# EasyEDA Pro project stm32控制的单相交流调压电路.eprj

# Schematic stm32控制的单相交流调压电路
Board Name: stm32控制的单相交流调压电路; Create Date: 2024-12-09; Page Name: main; Project Name: stm32控制的单相交流调压电路; Schematic Name: stm32控制的单相交流调压电路; Update Date: 2024-12-09; Company: 仲恺农业工程学院; Drawed: 自动化214呙凯锋; Page Size: A4; Version: V1.0
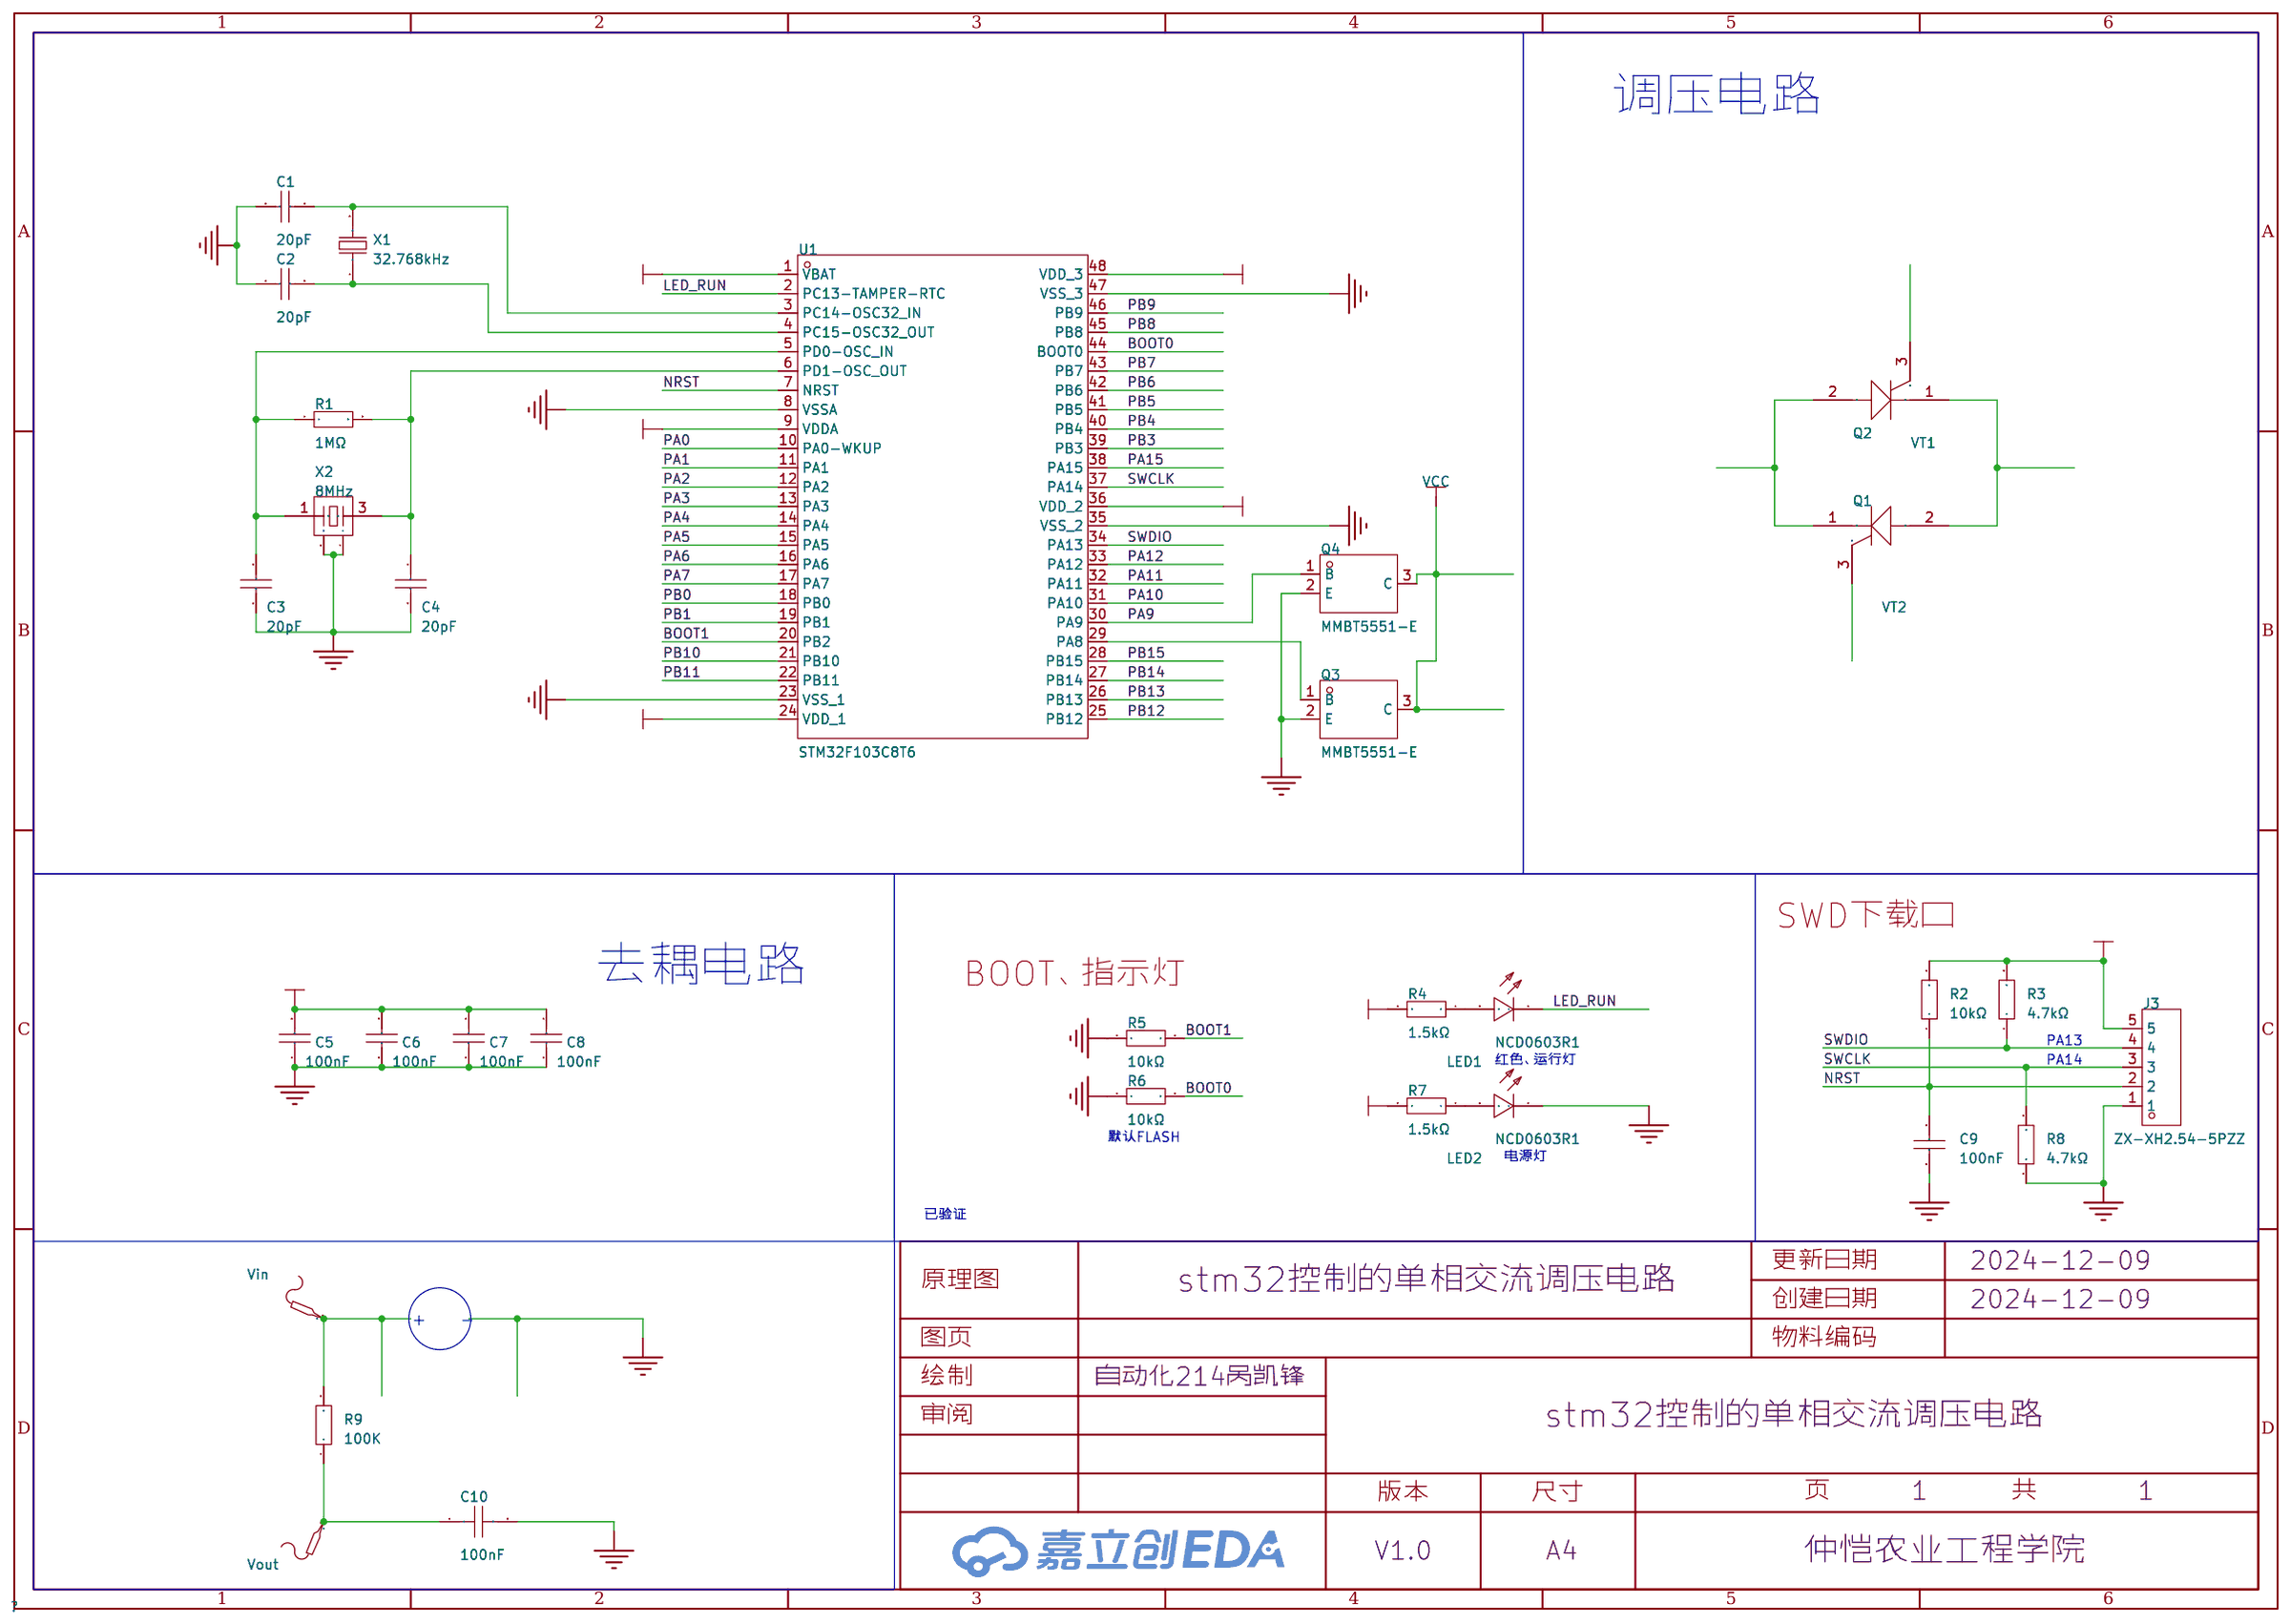
[diagram p0: schematic sheet]

## Parts
C1  20pF  [C0603]
C2  20pF  [C0603]
C3  20pF  [C0603]
C4  20pF  [C0603]
C5  100nF  [C0603]
C6  100nF  [C0603]
C7  100nF  [C0603]
C8  100nF  [C0603]
C9  100nF  [C0603]
C10  100nF  [C0603]
J3  ZX-XH2.54-5PZZ  [CONN-TH_5P-P2.50_ZX-XH2.54-5PZZ]
LED1  NCD0603R1  [LED0603-RD_RED]
LED2  NCD0603R1  [LED0603-RD_RED]
Q1  VT2  [DPAK-3_L6.6-W6.1-P2.28-LS9.9-BR]
Q2  VT1  [DPAK-3_L6.6-W6.1-P2.28-LS9.9-BR]
Q3  MMBT5551-E  [SOT-23-3_L2.9-W1.8-P1.90-LS2.4-BR]
Q4  MMBT5551-E  [SOT-23-3_L2.9-W1.8-P1.90-LS2.4-BR]
R1  1MΩ  [R0603]
R2  10kΩ  [R0603]
R3  4.7kΩ  [R0603]
R4  1.5kΩ  [R0603]
R5  10kΩ  [R0603]
R6  10kΩ  [R0603]
R7  1.5kΩ  [R0603]
R8  4.7kΩ  [R0603]
R9  100K  [R0603]
U1  STM32F103C8T6  [LQFP-48_L7.0-W7.0-P0.50-LS9.0-BL]
Vin  -  [Test-Point-0.5mm]
Vout  -  [Test-Point-0.5mm]
X1  32.768kHz  [FC-135R_L3.2-W1.5]
X2  8MHz  [OSC-SMD_4P-L5.0-W3.2-BL]

## Library data of the parts
C1-C4 = CL10C200JB8NNNC: 容值:20pF;精度:±5%;额定电压:50V;材质(温度系数):C0G;; LCSC Part Name: 20pF ±5% 50V; Supplier Part: C1648; Manufacturer: SAMSUNG(三星); Supplier Footprint: 0603; JLCPCB Part Class: 基础库; Datasheet: https://atta.szlcsc.com/upload/public/pdf/source/20160218/1457707763339.pdf; Supplier: LCSC; Tolerance: ±5%; Voltage Rated: 50V; Temperature Coefficient: C0G
C5-C9 = CC0603KRX7R9BB104: 容值:100nF;精度:±10%;额定电压:50V;材质(温度系数):X7R;; LCSC Part Name: 100nF ±10% 50V; Supplier Part: C14663; Manufacturer: YAGEO(国巨); Supplier Footprint: 0603; JLCPCB Part Class: 基础库; Datasheet: https://atta.szlcsc.com/upload/public/pdf/source/20180910/C282072_33301C7F631E79921B82A8DAC6BCC5B3.pdf; Supplier: LCSC; Tolerance: ±10%; Voltage Rated: 50V; Temperature Coefficient: X7R
C10 = CAP_0603: Supplier Footprint: 0603
J3 = ZX-XH2.54-5PZZ: 插针结构:1x5P;间距:2.54mm;安装方式:直插;参考系列:XH;总PIN数:5P;排数:1;每排PIN数:5;行距:-;额定电流:3A;触头材质:黄铜;触头镀层:锡;工作温度范围:-25℃~+85℃;; Supplier Part: C7429635; Manufacturer: Megastar(兆星); Supplier Footprint: 插件,P=2.54mm; JLCPCB Part Class: 扩展库; Datasheet: https://atta.szlcsc.com/upload/public/pdf/source/20230619/60EEF4ADD558E90BFFACF5D939816781.pdf; Supplier: LCSC; Pins Structure: 1x5P; Pitch: 2.54mm; Mounting Style: 直插; Reference Series: XH; Number of Pins: 5P; Number of Rows: 1; Number of PINs Per Row: 5; Current Rating (Max): 3A; Contact Material: 黄铜; Contact Plating: 锡; Operating Temperature Range: -25℃~+85℃
LED1 LED2 = NCD0603R1_C84263: 灯头类型:-;发光颜色:红色;正向电压(VF):1.6V~2.6V;功率:65mW;正向电流:20mA;主波长:615nm~630nm;二极管配置:独立二极管;透镜颜色:无色透明透镜;色温:-;发光强度:80mcd~220mcd;发光角度:130°;载带方式:-;工作温度:-30℃~+85℃;; Supplier Part: C84263; Manufacturer: 国星光电; Supplier Footprint: 0603; JLCPCB Part Class: 扩展库; Datasheet: https://atta.szlcsc.com/upload/public/pdf/source/20200820/C84263_DABC6A75E58F576973B407FDBA283D60.pdf; Supplier: LCSC; Emitted Color: 红色; Forward Voltage (VF): 1.6V~2.6V; Power Dissipation: 65mW; Forward Current: 20mA; Dominant Wavelength: 615nm~630nm; Diode Configuration: 独立二极管; Lens Color: 无色透明透镜; Luminous Intensity: 80mcd~220mcd; Viewing Angle: 130°; Operating Temperature: -30℃~+85℃
Q1 Q2 = BT151S-500R,118: 可控硅类型:1个单向可控硅;保持电流(Ih):20mA;断态峰值电压(Vdrm):500V;门极触发电流(Igt):15mA;; Supplier Part: C909686; Manufacturer: WeEn(瑞能); Supplier Footprint: DPAK; JLCPCB Part Class: 扩展库; Datasheet: https://atta.szlcsc.com/upload/public/pdf/source/20201023/C909686_0B35B9AF067EED6C5B9ABE2201E4480A.pdf; Supplier: LCSC; SCR Type: 1个单向可控硅; Gate Trigger   Voltage (Vgt): 1.5V; Holding Current (Ih): 20mA; Peak Repetitive Off?State Voltage (Vdrm): 500V; Gate Trigger Current(Igt): 15mA; Peak Forward On?State Voltage (Vtm): 1.75V; RMS On-State Current(It (rms)): 12A; Operating Temperature: -40℃~+125℃
Q3 Q4 = MMBT5551-E: 晶体管类型:NPN;集电极电流(Ic):600mA;集射极击穿电压(Vceo):160V;功率(Pd):300mW;直流电流增益(hFE@Ic,Vce):80@1mA,5V;; LCSC Part Name: NPN 电流:600mA 耐压:160V; Supplier Part: C41371418; Manufacturer: MDD(辰达半导体); Supplier Footprint: SOT-23; JLCPCB Part Class: 扩展库; Datasheet: https://atta.szlcsc.com/upload/public/pdf/source/20241113/0C9B68AE5C245EBCD1861CC91D852F33.pdf; Supplier: LCSC; Transistor Type: NPN; Collector Current (Ic): 600mA; Collector-Emitter Breakdown Voltage (Vceo): 160V; Power Dissipation (Pd): 300mW; DC Current Gain (hFE@Ic,Vce): 80@1mA,5V; Transition Frequency (fT): 100MHz; Collector Cut-Off Current (Icbo): 50nA; Collector-Emitter Saturation Voltage (VCE(sat)@Ic,Ib): 150mV@10mA,1mA; Operating Temperature: -55℃~+150℃
R1 = 0603WAF1004T5E: 电阻类型:厚膜电阻;阻值:1MΩ;精度:±1%;功率:100mW;最大工作电压:75V;温度系数:±100ppm/℃;; LCSC Part Name: 1MΩ ±1% 100mW 厚膜电阻; Supplier Part: C22935; Manufacturer: UNI-ROYAL(厚声); Supplier Footprint: 0603; JLCPCB Part Class: 基础库; Datasheet: https://atta.szlcsc.com/upload/public/pdf/source/20200306/C422600_1E6D84923E4A46A82E41ADD87F860B5C.pdf; Supplier: LCSC; Type: 厚膜电阻; Tolerance: ±1%; Power(Watts): 100mW; Overload Voltage (Max): 75V; Temperature Coefficient: ±100ppm/℃; Operating Temperature Range: -55℃~+155℃
R2 R5 R6 = 0603WAF1002T5E: 电阻类型:厚膜电阻;阻值:10kΩ;精度:±1%;功率:100mW;最大工作电压:75V;温度系数:±100ppm/℃;; LCSC Part Name: 厚膜电阻 10kΩ ±1% 100mW; Supplier Part: C25804; Manufacturer: UNI-ROYAL(厚声); Supplier Footprint: 0603; JLCPCB Part Class: 基础库; Datasheet: https://atta.szlcsc.com/upload/public/pdf/source/20200306/C422600_1E6D84923E4A46A82E41ADD87F860B5C.pdf; Supplier: LCSC; Type: 厚膜电阻; Tolerance: ±1%; Power(Watts): 100mW; Overload Voltage (Max): 75V; Temperature Coefficient: ±100ppm/℃; Operating Temperature Range: -55℃~+155℃
R3 R8 = 0603WAF4701T5E: 电阻类型:厚膜电阻;阻值:4.7kΩ;精度:±1%;功率:100mW;最大工作电压:75V;温度系数:±100ppm/℃;; LCSC Part Name: 4.7kΩ ±1% 100mW 厚膜电阻; Supplier Part: C23162; Manufacturer: UNI-ROYAL(厚声); Supplier Footprint: 0603; JLCPCB Part Class: 基础库; Datasheet: https://atta.szlcsc.com/upload/public/pdf/source/20200306/C422600_1E6D84923E4A46A82E41ADD87F860B5C.pdf; Supplier: LCSC; Type: 厚膜电阻; Tolerance: ±1%; Power(Watts): 100mW; Overload Voltage (Max): 75V; Temperature Coefficient: ±100ppm/℃; Operating Temperature Range: -55℃~+155℃
R4 R7 = 0603WAF1501T5E: 电阻类型:厚膜电阻;阻值:1.5kΩ;精度:±1%;功率:100mW;最大工作电压:75V;温度系数:±100ppm/℃;; LCSC Part Name: 1.5kΩ ±1% 100mW 厚膜电阻; Supplier Part: C22843; Manufacturer: UNI-ROYAL(厚声); Supplier Footprint: 0603; Datasheet: https://atta.szlcsc.com/upload/public/pdf/source/20200306/C422600_1E6D84923E4A46A82E41ADD87F860B5C.pdf; Supplier: LCSC; Type: 厚膜电阻; Tolerance: ±1%; Power(Watts): 100mW; Overload Voltage (Max): 75V; Temperature Coefficient: ±100ppm/℃; Operating Temperature Range: -55℃~+155℃
R9 = Res_0603: Supplier Footprint: 0603
U1 = STM32F103C8T6: CPU内核:ARM-M3;程序存储容量:64KB;RAM总容量:20KB;GPIO端口数量:37;工作电压范围:2V~3.6V;CPU最大主频:72MHz;程序存储器类型:FLASH;; LCSC Part Name: 主流增强型ARM Cortex-M3 MCU，具有64 KB Flash、72 MHz CPU、电机控制、USB和CAN; Supplier Part: C8734; Manufacturer: ST(意法半导体); Supplier Footprint: LQFP-48(7x7); JLCPCB Part Class: 扩展库; Datasheet: https://atta.szlcsc.com/upload/public/pdf/source/20220812/8363ACEC51AD55ECEB84799464F7CB85.pdf; Supplier: LCSC; CPU Core: ARM-M3; Program Storage Size: 64KB; RAM Size: 20KB; GPIO Ports Number: 37; Operating Voltage Range: 2V~3.6V; CPU Maximum Speed: 72MHz; Program Memory Type: FLASH; Operating Temperature Range: -40℃~+85℃; ADC (Bit): 12bit; Universal Serial Bus: 有; Peripheral/Function: 看门狗；DMA；看门狗；温度传感器; Watchdog: 有; Infrared Data Association: 有; Low-Voltage Detect: 有; Direct Memory Access: 有; Internal Oscillator: 有
Vin Vout = Test-Point: Test Point 测试点
X1 = Q13FC13500004_C32346: 晶振类型:贴片晶振;频率:32.768kHz;常温频差:±20ppm;外接负载电容:12.5pF;; LCSC Part Name: 32.768kHz ±20ppm 12.5pF; Supplier Part: C32346; Manufacturer: EPSON(爱普生); Manufacturer Part: Q13FC13500004; Supplier Footprint: SMD3215-2P; JLCPCB Part Class: 基础库; Datasheet: https://atta.szlcsc.com/upload/public/pdf/source/20240418/0E0FF5F0356BA3753F616001439D1416.pdf; Supplier: LCSC; Crystal Type: 贴片晶振; Normal temperature Frequency Tolerance: ±20ppm; External load capacitor: 12.5pF; Equivalent Series Resistance (ESR): 70kΩ; Operating Temperature: -40℃~+85℃
X2 = X50328MSB4SI: 晶振类型:贴片晶振;频率:8MHz;常温频差:±10ppm;外接负载电容:20pF;频率稳定度(全温):±20ppm;; LCSC Part Name: 8MHz ±10ppm 20pF; Supplier Part: C157341; Manufacturer: YXC(扬兴晶振); Supplier Footprint: SMD5032-4P; JLCPCB Part Class: Extended Part; Datasheet: https://atta.szlcsc.com/upload/public/pdf/source/20240329/327CA683A00C8316374FE0D2B6DB5109.pdf; Supplier: LCSC; Crystal Type: 贴片晶振; Normal temperature Frequency Tolerance: ±10ppm; External load capacitor: 20pF; Frequency Stability(Full temperature range): ±20ppm; Operating Temperature: -40℃~+85℃; Origin Footprint 1: OSC 5032-4P; Design Item ID: XTAL-4P; Library Name: 2.0 - 保险丝-晶振-光耦; BOM名称: 4脚无源晶振; 学习资源: https://shop463601444.taobao.com; 版权归属: 封装库来自淘宝卖家 ID：黄晶宝石; Origin Footprint 2: OSC 1612-4P; Origin Footprint 3: OSC 2025-4P; Origin Footprint 4: OSC 3225-4P; Origin Footprint 5: OSC 4025-4P; Origin Footprint 6: OSC 6035-4P; Origin Footprint 7: OSC 7050-4P; Origin Footprint 8: OSC 8045-4P; Origin Footprint 9: OSC 8045-4P-C; Origin Footprint 10: OSC 2016-4P

## Nets
GND: C1.1 C2.1 C3.2 C4.2 C5.1 C6.1 C7.1 C8.1 C9.2 C10.2 J3.1 LED2.1(K) Q3.2(E) Q4.2(E) R5.1 R6.1 R8.1 U1.8(VSSA) U1.23(VSS_1) U1.35(VSS_2) U1.47(VSS_3) X2.2 X2.4
VCC: Q3.3(C) Q4.3(C)
VDD_3V3: C5.2 C6.2 C7.2 C8.2 J3.5 R2.2 R3.2 R4.2 R7.2 U1.1(VBAT) U1.9(VDDA) U1.24(VDD_1) U1.36(VDD_2) U1.48(VDD_3)
BOOT0: R6.2 U1.44(BOOT0)
BOOT1: R5.2 U1.20(PB2)
LED_RUN: LED1.1(K) U1.2(PC13-TAMPER-RTC)
NRST: C9.1 J3.2 R2.1 U1.7(NRST)
PA0: U1.10(PA0-WKUP)
PA1: U1.11(PA1)
PA2: U1.12(PA2)
PA3: U1.13(PA3)
PA4: U1.14(PA4)
PA5: U1.15(PA5)
PA6: U1.16(PA6)
PA7: U1.17(PA7)
PA9: Q4.1(B) U1.30(PA9)
PA10: U1.31(PA10)
PA11: U1.32(PA11)
PA12: U1.33(PA12)
PA15: U1.38(PA15)
PB0: U1.18(PB0)
PB1: U1.19(PB1)
PB3: U1.39(PB3)
PB4: U1.40(PB4)
PB5: U1.41(PB5)
PB6: U1.42(PB6)
PB7: U1.43(PB7)
PB8: U1.45(PB8)
PB9: U1.46(PB9)
PB10: U1.21(PB10)
PB11: U1.22(PB11)
PB12: U1.25(PB12)
PB13: U1.26(PB13)
PB14: U1.27(PB14)
PB15: U1.28(PB15)
SWCLK: J3.3 R8.2 U1.37(PA14)
SWDIO: J3.4 R3.1 U1.34(PA13)
$1N739: LED1.2(A) R4.1
$1N743: LED2.2(A) R7.1
$1N1095: C3.1 R1.1 U1.5(PD0-OSC_IN) X2.1
$1N1097: C4.1 R1.2 U1.6(PD1-OSC_OUT) X2.3
$1N1874: C2.2 U1.4(PC15-OSC32_OUT) X1.1
$1N1879: C1.2 U1.3(PC14-OSC32_IN) X1.2
$1N4613: Q1.2(A) Q2.1(K)
$1N4619: Q1.1(K) Q2.2(A)
$1N4761: Q3.1(B) U1.29(PA8)
$1N5233: R9.2 Vin.1
$1N5237: C10.1 R9.1 Vout.1

Not connected (* = marked no-connect by the designer): Q1 3(G); Q2 3(G)

## Notes on the sheet
- 调压电路
- SWD下载口
- 去耦电路
- BOOT、指示灯
- PA13
- 红色、运行灯
- PA14
- 默认FLASH
- 电源灯
- 已验证
- +
- -

# Board stm32控制的单相交流调压电路
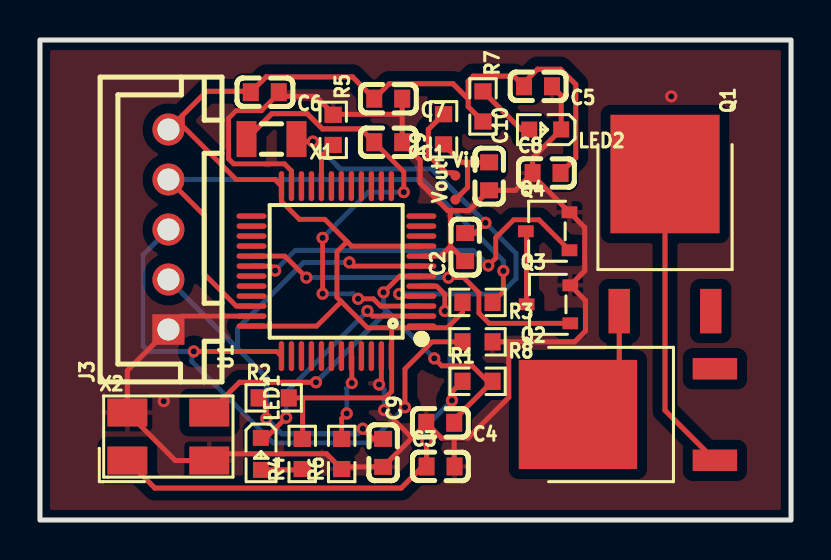
[diagram p1: board, top side]
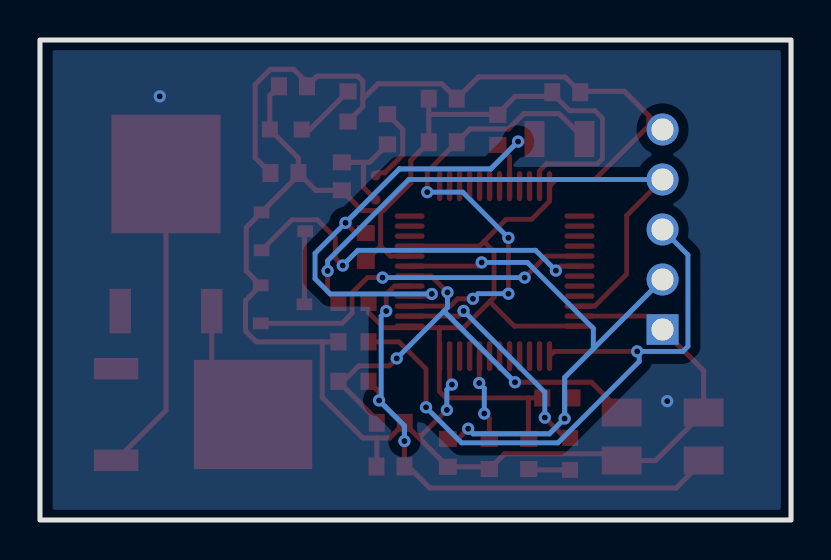
[diagram p2: board, bottom side, seen from below]

Outline 37.59 x 24 mm; copper layers: Top Layer, Bottom Layer. Coordinates in mm from the lower left corner of the outline.
Outline path: rectangle 0,24 37.59,0
Stack: Top Layer 0.035mm / Dielectric1 1.51mm FR4 er 4.5 / Bottom Layer 0.035mm

## Design rules (mm)
template: 自定义配置
spacing copperThickness1oz (default): track to track 0.102, other pairs 0.152 to 0.3
spacing copperThickness2oz: track to track 0.203, other pairs 0.152 to 0.3
track width copperThickness1oz (default): min 0.127, default 0.254, max 2.54
track width copperThickness2oz: min 0.203, default 0.254, max 2.54
differential pair differentialPair (default): width min 0.127, default 0.254, max 2.54; gap min 0.152, default 0.152
via viaSize (default): diameter min 0.5, default 0.61, max 10; hole min 0.3, default 0.305, max 6.3

## Placement (name value [footprint] x y rotation side)
C1  20pF  [C0603]  17.43 18.89 180 top
C2  20pF  [C0603]  21.28 13.65 90 top
C3  20pF  [C0603]  20.05 2.68 0 top
C4  20pF  [C0603]  20.03 4.86 180 top
C5  100nF  [C0603]  24.93 21.69 180 top
C6  100nF  [C0603]  11.25 21.39 180 top
C7  100nF  [C0603]  17.43 21.07 180 top
C8  100nF  [C0603]  25.36 17.35 0 top
C9  100nF  [C0603]  17.17 3.36 270 top
C10  100nF  [C0603]  22.48 17.19 270 top
J3  ZX-XH2.54-5PZZ  [CONN-TH_5P-P2.50_ZX-XH2.54-5PZZ]  6.43 14.53 90 top
LED1  NCD0603R1  [LED0603-RD_RED]  11.06 3.31 270 top
LED2  NCD0603R1  [LED0603-RD_RED]  25.29 19.52 180 top
Q1  VT2  [DPAK-3_L6.6-W6.1-P2.28-LS9.9-BR]  31.28 13.87 270 top
Q2  VT1  [DPAK-3_L6.6-W6.1-P2.28-LS9.9-BR]  30.35 5.27 0 top
Q3  MMBT5551-E  [SOT-23-3_L2.9-W1.8-P1.90-LS2.4-BR]  25.45 10.79 0 top
Q4  MMBT5551-E  [SOT-23-3_L2.9-W1.8-P1.90-LS2.4-BR]  25.41 14.44 0 top
R1  1MΩ  [R0603]  21.9 6.94 0 top
R2  10kΩ  [R0603]  11.7 6.11 0 top
R3  4.7kΩ  [R0603]  21.9 10.88 180 top
R4  1.5kΩ  [R0603]  13.13 3.3 90 top
R5  10kΩ  [R0603]  14.68 19.51 270 top
R6  10kΩ  [R0603]  15.1 3.3 90 top
R7  1.5kΩ  [R0603]  22.17 20.68 270 top
R8  4.7kΩ  [R0603]  21.9 8.91 180 top
R9  100K  [R0603]  20.2 19.54 90 top
U1  STM32F103C8T6  [LQFP-48_L7.0-W7.0-P0.50-LS9.0-BL]  14.84 12.45 90 top
Vin  -  [Test-Point-0.5mm]  20.79 17.22 0 top
Vout  -  [Test-Point-0.5mm]  20.79 16.02 90 top
X1  32.768kHz  [FC-135R_L3.2-W1.5]  11.59 19.05 180 top
X2  8MHz  [OSC-SMD_4P-L5.0-W3.2-BL]  6.43 4.17 0 top

## Footprints (pads in the part's own frame, mm; a bottom-side part is the same pattern mirrored in y, then rotated)
C0603
  rect 0.8x0.9 smd: 1(-0.7,0) 2(0.7,0)
CONN-TH_5P-P2.50_ZX-XH2.54-5PZZ
  rect 1.524x1.6 hole 1.1: 1(-5,0)
  round 1.6 hole 1.1: 2(-2.5,0) 3(0,0) 4(2.5,0) 5(5,0)
DPAK-3_L6.6-W6.1-P2.28-LS9.9-BR
  rect 2.223x1.071 smd: 1(3.428,-2.29) 3(3.428,2.29)
  rect 5.925x5.46 smd: 2(-3.428,0)
FC-135R_L3.2-W1.5
  rect 1x1.8 smd: 1(-1.25,0) 2(1.25,0)
LED0603-RD_RED
  rect 0.8x0.8 smd: 1(-0.799,-0.004) 2(0.799,0.004)
LQFP-48_L7.0-W7.0-P0.50-LS9.0-BL
  oval 0.27x1.5 smd: 1(-2.75,-4.25) 2(-2.25,-4.25) 3(-1.75,-4.25) 4(-1.25,-4.25) 5(-0.75,-4.25) 6(-0.25,-4.25) 7(0.25,-4.25) 8(0.75,-4.25) 9(1.25,-4.25) 10(1.75,-4.25) 11(2.25,-4.25) 12(2.75,-4.25) 25(2.75,4.25) 26(2.25,4.25) 27(1.75,4.25) 28(1.25,4.25) 29(0.75,4.25) 30(0.25,4.25) 31(-0.25,4.25) 32(-0.75,4.25) 33(-1.25,4.25) 34(-1.75,4.25) 35(-2.25,4.25) 36(-2.75,4.25)
  oval 1.5x0.27 smd: 13(4.25,-2.75) 14(4.25,-2.25) 15(4.25,-1.75) 16(4.25,-1.25) 17(4.25,-0.75) 18(4.25,-0.25) 19(4.25,0.25) 20(4.25,0.75) 21(4.25,1.25) 22(4.25,1.75) 23(4.25,2.25) 24(4.25,2.75) 37(-4.25,2.75) 38(-4.25,2.25) 39(-4.25,1.75) 40(-4.25,1.25) 41(-4.25,0.75) 42(-4.25,0.25) 43(-4.25,-0.25) 44(-4.25,-0.75) 45(-4.25,-1.25) 46(-4.25,-1.75) 47(-4.25,-2.25) 48(-4.25,-2.75)
OSC-SMD_4P-L5.0-W3.2-BL
  rect 2x1.4 smd: 1(-2.05,-1.2) 2(2.05,-1.2) 3(2.05,1.2) 4(-2.05,1.2)
R0603
  rect 0.806x0.864 smd: 1(-0.753,0) 2(0.753,0)
SOT-23-3_L2.9-W1.8-P1.90-LS2.4-BR
  rect 0.785x0.595 smd: 1(1.093,-0.95) 2(1.093,0.95) 3(-1.093,0)
Test-Point-0.5mm
  round 0.5 smd: 1(0,0)

## Nets
As in the schematic.

## Via types
v1: diameter 0.61, hole 0.305, Top Layer to Bottom Layer, 31 vias

## Routing (per net, layer and track width the routed paths; a pad name or vN(x,y) marks a point on that pad's centre or on a via; arc(x,y) is an arc through that point)
GND: length 92.8
  Top Layer w0.243: v1(17.23,5.5) 18.5,4.23 18.75,4.23 ; v1(16.97,6.77) 17.09,6.89 17.09,8.2 ; 11.98,21.36 11.08,20.47 9.81,20.47 9.44,20.09 9.44,18.06 9.7,17.81 12.24,17.81 12.59,17.46 U1.23 ; U1.8 20.05,13.2 20.54,13.69 ; U1.35 7.1,10.2 J3.1
  Top Layer w0.254: 20.54,15.47 20.42,15.47 19.03,16.86 19.03,17.99 C1.1 18.13,20.29 ; 20.54,15.47 20.54,13.69 21.28,12.95 ; 20.54,15.47 21.46,15.47 C10.2 23.79,16.49 24.46,17.16 ; C5.1 26.09,21.23 LED2.1 24.66,18.1 C8.1 24.46,17.16 ; 23.46,8.91 23.46,6.13 21.43,4.1 20.73,4.1 ; 23.46,8.91 R8.1 ; 23.46,8.91 26.76,8.91 27.3,9.45 27.3,10.97 Q3.2 27.27,12.46 27.27,14.63 Q4.2 24.73,17.16 24.46,17.16 ; 20.73,4.1 20.1,4.1 C4.2 19.33,4.82 18.75,4.23 C9.2 15.21,2.66 R6.1 14.34,3.31 8.81,3.31 8.48,2.97 6.77,2.97 X2.4 4.38,7.47 J3.1 ; 20.73,4.1 20.73,2.69 C3.2 ; 14.7,20.29 R5.1 ; 14.7,20.29 18.13,20.29 ; 14.7,20.29 13.8,21.18 12.16,21.18 C6.1 ; 18.13,20.29 C7.1
  Bottom Layer w0.243: v1(16.97,6.77) 17.23,6.52 v1(17.23,5.5)
  vias: v1(6.2,5.94) v1(31.6,21.18)
VCC: length 3.7
  Top Layer w0.254: Q4.3 24.36,14.4 Q3.3
VDD_3V3: length 72.5
  Top Layer w0.243: 19.17,9.61 U1.1 ; 19.17,9.61 17.6,9.61 ; 19.17,9.61 20.39,9.61 21.15,10.38 R3.2 ; 17.6,9.61 16.39,9.61 15.08,10.92 ; 17.6,9.61 17.6,8.21 ; 15.08,10.92 13.85,9.7 U1.36 ; 15.08,10.92 14.86,11.14 14.86,13.41 15.37,13.92 ; 15.37,13.92 15.6,13.7 U1.9 ; 15.37,13.92 14.26,15.04 12.99,15.04 12.09,15.93 U1.24 11.76,17.02 9.82,17.02 7.13,19.72 7.13,20.23 ; R2.2 17.28,6.11 17.6,6.43 17.6,8.21 ; 17.6,8.21 17.59,8.2
  Top Layer w0.254: C5.2 24.14,21.78 ; 24.14,21.78 23.72,22.2 21.69,22.2 21.43,21.94 21.43,21.05 ; 24.14,21.78 24.9,22.54 26.06,22.54 26.82,21.78 26.82,18.11 C8.2 ; 13.15,6.11 13.15,4.07 R4.2 ; 10.6,21.44 11.32,22.16 15.64,22.16 C7.2 17.48,21.82 20.67,21.82 21.43,21.05 ; 10.6,21.44 8.34,21.44 J3.5 ; 10.6,21.44 C6.2 ; 21.43,21.05 21.43,20.67 R7.2
BOOT0: length 4.4
  Top Layer w0.243: v1(15.35,5.32) 15.1,5.07 R6.2 ; 15.59,8.2 15.61,8.18 v1(15.61,6.85)
  Bottom Layer w0.243: v1(15.61,6.85) 15.35,6.59 v1(15.35,5.32)
BOOT1: length 2.3
  Top Layer w0.243: R5.2 14.09,18.17 U1.20
LED_RUN: length 11.5
  Top Layer w0.243: U1.2 16.65,10.2 v1(16.39,10.45) ; v1(12.33,5.12) 11.31,4.1 LED1.1
  Bottom Layer w0.243: v1(12.33,5.12) 12.33,6.39 v1(16.39,10.45)
NRST: length 28.3
  Top Layer w0.243: U1.7 15.67,12.7 v1(15.48,12.88)
  Top Layer w0.254: R2.1 11.33,5.72 v1(11.33,5.07) ; v1(16.16,4.56) 16.67,4.06 C9.1
  Bottom Layer w0.243: v1(15.48,12.88) 13.2,12.88 9.9,9.58 9.9,8.56
  Bottom Layer w0.254: v1(16.16,4.56) 15.9,4.31 12.09,4.31 v1(11.33,5.07) 11.33,7.12 9.9,8.56 J3.2
PA9: length 18.9
  Top Layer w0.243: U1.30 11.55,12.7 v1(11.77,12.47) ; 26.5,13.49 24.98,15.01 23.71,15.01 22.81,14.11 22.81,13.1 v1(22.44,12.73)
  Bottom Layer w0.243: v1(22.44,12.73) 21.68,13.49 12.79,13.49 v1(11.77,12.47)
SWCLK: length 32.5
  Top Layer w0.243: R8.2 19.62,8.91 18.27,7.55 v1(18.27,5.64) ; 12.09,8.2 11.85,8.43 v1(7.7,8.43)
  Bottom Layer w0.243: v1(18.27,5.64) 16.49,3.86 11.67,3.86 7.6,7.92 7.6,8.43 ; 7.6,8.43 5.41,8.43 5.16,8.68 5.16,13.26 J3.3 ; 7.6,8.43 v1(7.7,8.43)
SWDIO: length 29.3
  Top Layer w0.243: U1.34 9.83,10.7 8.23,12.3 8.23,15.23 J3.4 ; v1(23.19,12.45) 23.19,11.42 R3.1
  Bottom Layer w0.243: v1(23.19,12.45) 23.19,12.96 19.13,17.03 J3.4
$1N739: length 2.1
  Top Layer w0.254: LED1.2 13.08,2.51 R4.1
$1N743: length 3.1
  Top Layer w0.254: R7.1 24.09,19.52 LED2.2
$1N1095: length 27.9
  Top Layer w0.243: U1.5 19.85,11.7 20.26,11.28 v1(20.26,10.45)
  Top Layer w0.254: C3.1 19.35,2.87 ; 19.35,2.87 v1(19.35,3.95) ; 19.35,2.87 18.08,1.6 5.75,1.6 4.38,2.97 ; R1.1 20.62,6.41 v1(20.62,5.98)
  Bottom Layer w0.243: v1(20.26,10.45) 20.52,10.19 20.52,5.88
  Bottom Layer w0.254: v1(20.62,5.98) 19.35,4.71 v1(19.35,3.95)
$1N1097: length 23.8
  Top Layer w0.243: v1(17.2,11.38) 18.01,12.2 U1.6 ; 22.53,6.81 21.63,7.71 20.11,7.71 v1(19.74,8.08)
  Top Layer w0.254: C4.1 20.73,5.02 22.53,6.81 R1.2 ; X2.3 9.99,6.89 v1(13.82,6.89)
  Bottom Layer w0.243: v1(17.2,11.38) 17.2,10.62 17.37,10.44 v1(19.74,8.08)
  Bottom Layer w0.254: 17.37,10.44 v1(13.82,6.89)
$1N1874: length 23.2
  Top Layer w0.243: v1(22.3,14.86) 21.79,14.35 C2.2 ; v1(17.98,11.3) 18.09,11.2 U1.4
  Top Layer w0.254: v1(13.66,18.92) 12.96,18.92 X1.1
  Bottom Layer w0.243: v1(17.98,11.3) 23.06,11.3 23.82,12.07 23.82,13.34 v1(22.3,14.86)
  Bottom Layer w0.254: v1(13.66,18.92) 15.03,17.55 19.6,17.55 v1(22.3,14.86)
$1N1879: length 23.6
  Top Layer w0.243: v1(18.21,16.39) 18.21,17.41 C1.2 ; v1(15.92,11.06) 16.69,11.06 17.05,10.7 U1.3 ; v1(14.15,14.11) v1(14.15,11.31)
  Top Layer w0.254: X1.2 11.61,20.32 13.38,20.32 14.14,19.56 16.06,19.56 C1.2
  Bottom Layer w0.243: v1(14.15,11.31) 15.67,11.31 v1(15.92,11.06) ; v1(18.21,16.39) 16.43,16.39 v1(14.15,14.11)
$1N4613: length 15.4
  Top Layer w0.254: Q1.2 31.28,5.48 Q2.1
$1N4619: length 6
  Top Layer w0.254: Q1.1 28.99,7.34 Q2.2
$1N4761: length 17.9
  Top Layer w0.243: U1.29 12.26,13.2 v1(13.33,12.12) ; Q3.1 22.48,9.84 21.97,10.34 21.97,11.36 21.21,12.12 v1(20.45,12.12)
  Bottom Layer w0.243: v1(20.45,12.12) v1(13.33,12.12)
$1N5233: length 4.1
  Top Layer w0.254: Vin.1 20.66,17.36 20.34,17.36 19.44,18.26 19.44,19.53 R9.2
$1N5237: length 4.8
  Top Layer w0.254: R9.1 21.1,17.89 21.4,17.89 ; C10.1 21.4,17.89 ; 21.4,17.89 21.4,16.63 Vout.1

## Copper pours and planes (outline as drawn; the poured copper is in the pictures)
GND on Top Layer: 1.02,22.99 36.83,22.99 36.83,0.76 1.02,0.76
GND on Top Layer: 0,24 37.59,24 37.59,0.2 0,0.2
GND on Bottom Layer: 0.51,23.49 36.96,23.49 36.96,0.51 0.51,0.51
